# Altium schematic sheet Led.SchDoc
size A
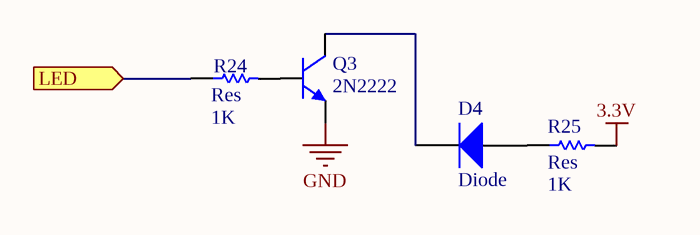
[diagram p0: Led.SchDoc]

## Parts
D4  Diode  [2012[0805]]
Q3  2N2222  [SOT-23]
R24  Res  value 1K  [2012[0805]]
R25  Res  value 1K  [2012[0805]]

## Ports
LED (in)

## Nets
3.3V: R25.2
GND: Q3.3(E)
LED: R24.1 ; port LED
NetD4_1: D4.1(A) R25.1
NetD4_2: D4.2(K) Q3.1(C)
NetQ3_2: Q3.2(B) R24.2

## Library data of the parts
D4 = Diode: 1 Amp General Purpose Rectifier; Revision 1: 11-Jul-2000: SIM Model Added.; Revision 2: 17-Jul-2002: Re-released for DXP Platform.; Package Information: Latest Revision: Aug-1999; Code - JEDEC: DO-204-AL; Published: 8-Jun-2000; Datasheet: Latest Revision: 1998; Package Reference: DO-41; Publisher: Altium Limited
Q3 = 2N2222: NPN Bipolar Transistor; Published: 8-Jun-2000; LatestRevisionDate: 17-Jul-2002; LatestRevisionNote: Re-released for DXP Platform.; PackageReference: TO-226; Publisher: Altium Limited; Code_JEDEC: TO-226-AA
R24 R25 = Res: Semiconductor Resistor; Published: 8-Jun-2000; LatestRevisionDate: 17-Jul-2002; LatestRevisionNote: Re-released for DXP Platform.; PackageReference: AXIAL-0.5; Publisher: Altium Limited